# Altium schematic sheet freePort.SchDoc: DE:TMP:11:UC:EXPANDIDO
size 142 x 83 mm; Date: 21-07-2022; SheetNumber: 1; SheetTotal: 1; WebFGR: www.abebashop.com; VersionFGR: 20220721; PageSetup: Record=PageOptions|CenterHorizontal=True|CenterVertical=True|PrintScale=0.94|XCorrection=1.00|YCorrection=1.00|PrintKind=0|BorderSize=5000000|LeftOffset=0|BottomOffset=0|Orientation=2|PaperLength=1000|PaperWidth=1000|Scale=100|PaperSource=7|PrintQuality=-4|MediaType=1|DitherType=10|PaperKind=Letter|PrintScaleMode=1
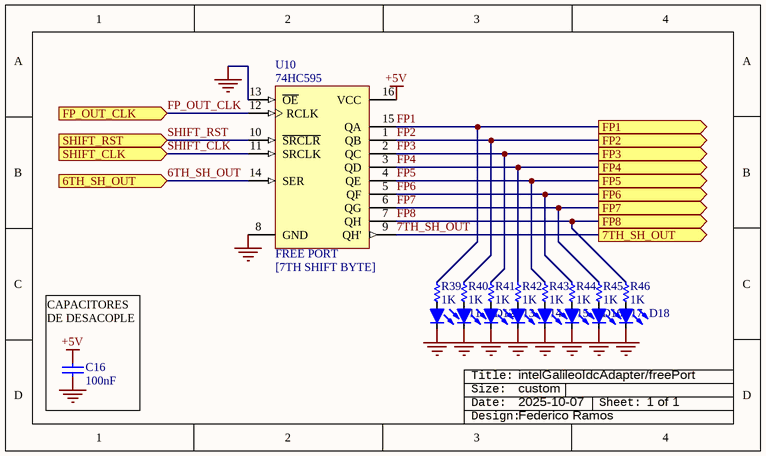
[diagram p0: freePort.SchDoc]

## Parts
C16  value 100nF  [c1206]  (hidden comment: Cap)
D11  LED  [3528]  (value not drawn)
D12  LED  [3528]  (value not drawn)
D13  LED  [3528]  (value not drawn)
D14  LED  [3528]  (value not drawn)
D15  LED  [3528]  (value not drawn)
D16  LED  [3528]  (value not drawn)
D17  LED  [3528]  (value not drawn)
D18  LED  [3528]  (value not drawn)
R39  value 1K  [R1206]  (hidden comment: Res)
R40  value 1K  [R1206]  (hidden comment: Res)
R41  value 1K  [R1206]  (hidden comment: Res)
R42  value 1K  [R1206]  (hidden comment: Res)
R43  value 1K  [R1206]  (hidden comment: Res)
R44  value 1K  [R1206]  (hidden comment: Res)
R45  value 1K  [R1206]  (hidden comment: Res)
R46  value 1K  [R1206]  (hidden comment: Res)
ROT?  Rotulo_empty  (value not drawn)  (graphical)
U10  74HC595  [DIP16]

## Ports
6TH_SH_OUT (in), 7TH_SH_OUT (out), FP1 (out), FP2 (out), FP3 (out), FP4 (out), FP5 (out), FP6 (out), FP7 (out), FP8 (out), FP_OUT_CLK (in), SHIFT_CLK (in), SHIFT_RST (in)

## Nets
+5V: C16.2 U10.16(VCC)
GND: C16.1 D11.2(K) D12.2(K) D13.2(K) D14.2(K) D15.2(K) D16.2(K) D17.2(K) D18.2(K) U10.8(GND) U10.13(~{OE})
6TH_SH_OUT: U10.14(SER) ; port 6TH_SH_OUT
7TH_SH_OUT: U10.9(QH') ; port 7TH_SH_OUT
FP1: R39.2 U10.15(QA) ; port FP1
FP2: R40.2 U10.1(QB) ; port FP2
FP3: R41.2 U10.2(QC) ; port FP3
FP4: R42.2 U10.3(QD) ; port FP4
FP5: R43.2 U10.4(QE) ; port FP5
FP6: R44.2 U10.5(QF) ; port FP6
FP7: R45.2 U10.6(QG) ; port FP7
FP8: R46.2 U10.7(QH) ; port FP8
FP_OUT_CLK: U10.12(RCLK) ; port FP_OUT_CLK
SHIFT_CLK: U10.11(SRCLK) ; port SHIFT_CLK
SHIFT_RST: U10.10(~{SRCLR}) ; port SHIFT_RST
NetD11_1: D11.1(A) R39.1
NetD12_1: D12.1(A) R40.1
NetD13_1: D13.1(A) R41.1
NetD14_1: D14.1(A) R42.1
NetD15_1: D15.1(A) R43.1
NetD16_1: D16.1(A) R44.1
NetD17_1: D17.1(A) R45.1
NetD18_1: D18.1(A) R46.1

## Notes on the sheet
- (near C16) CAPACITORES DE DESACOPLE
- intelGalileoIdcAdapter/freePort
- custom
- 2025-10-07
- 1 of 1
- Federico Ramos
- (in symbol 74HC595) FREE PORT; [7TH SHIFT BYTE]
- (in symbol Rotulo_empty) Title:; Size:; Date:; Sheet:; Design:

## Library data of the parts
C16 = Cap: Capacitor; Voltage: 50V; Price: 0.25; Technology: Ceramic
D11-D18 = LED: Color: Green; Price: ?
R39-R46 = Res: Resistencia; Power: 0.25W; Price: 0.036
ROT? = Rotulo_empty: Rotulo [consolas]
U10 = 74HC595: 8-Bit Shift Register with 3-State Output Registers